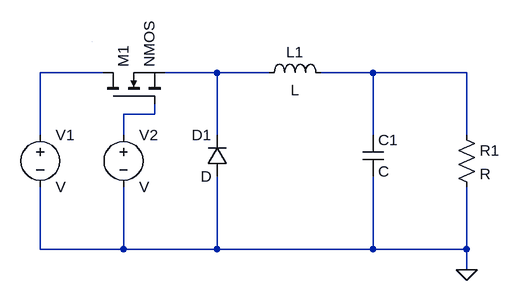
[diagram p0: schematic Draft1.asc]
Draft1.asc, the LTspice schematic file:
Version 4.1
SHEET 1 880 680
WIRE 16 48 -80 48
WIRE 192 48 112 48
WIRE 272 48 192 48
WIRE 432 48 352 48
WIRE 576 48 432 48
WIRE 96 112 96 96
WIRE 96 112 48 112
WIRE -80 144 -80 48
WIRE 48 144 48 112
WIRE 192 144 192 48
WIRE 432 144 432 48
WIRE 576 144 576 48
WIRE -80 320 -80 224
WIRE 48 320 48 224
WIRE 48 320 -80 320
WIRE 192 320 192 208
WIRE 192 320 48 320
WIRE 432 320 432 208
WIRE 432 320 192 320
WIRE 576 320 576 224
WIRE 576 320 432 320
WIRE 576 352 576 320
WIRE 0 0 0 0
FLAG 576 352 0
SYMBOL voltage -80 128 R0
SYMATTR InstName V1
SYMBOL nmos 16 96 R270
SYMATTR InstName M1
SYMBOL diode 208 208 R180
WINDOW 0 24 64 Left 2
WINDOW 3 24 0 Left 2
SYMATTR InstName D1
SYMBOL ind 256 64 R270
WINDOW 0 32 56 VTop 2
WINDOW 3 5 56 VBottom 2
SYMATTR InstName L1
SYMBOL cap 416 144 R0
SYMATTR InstName C1
SYMBOL res 560 128 R0
SYMATTR InstName R1
SYMBOL voltage 48 128 R0
SYMATTR InstName V2

The netlist it stands for:
* Draft1.asc
V1 N001 0 V
M1 N001 N004 N002 N002 NMOS
D1 0 N002 D
L1 N002 N003 L
C1 N003 0 C
R1 N003 0 R
V2 N004 0 V
.model D D
.lib standard.dio
.model NMOS NMOS
.model PMOS PMOS
.lib standard.mos
.backanno
.end